# Altium schematic sheet STMkaN.SchDoc
size 209 x 297 mm; 1_Listov: 1; 1_Naimenovanie1: Плата отладочная; 1_Naimenovanie2: STMka-NANO 2v0; 1_Naimenovanie3: Схема электрическая принципиальная; 1_Oboznachenie: КДМТ.466961.001 Э3; 1_T1Razrabotal: Карманов Д.; 1_T2Proveril: Муханов Т.; 1_PervPrimen: КДМТ466961.001; PageSetup: Record=PageOptions|CenterHorizontal=True|CenterVertical=True|PrintScale=0.99|XCorrection=1.00|YCorrection=1.00|PrintKind=2|BorderSize=5000000|LeftOffset=0|BottomOffset=0|Orientation=1|PaperLength=1000|PaperWidth=1000|Scale=100|PaperSource=258|PrintQuality=-3|MediaType=1|DitherType=10|PrintScaleMode=1|PaperKind=A4|PaperIndex=9
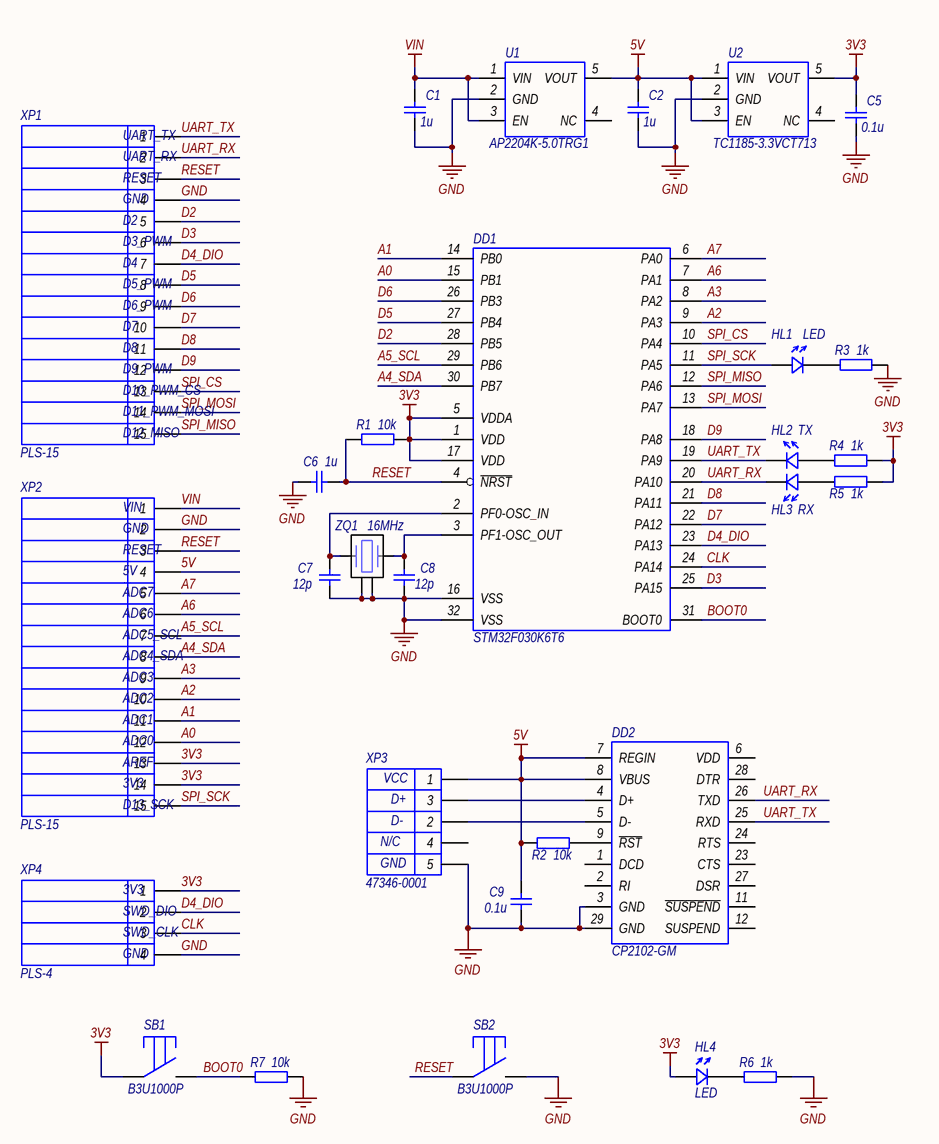
[diagram p0: STMkaN.SchDoc]

## Parts
C1  1u  [0603C]
C2  1u  [0603C]
C5  0.1u  [0603C]
C6  1u  [0603C]
C7  12p  [0603C]
C8  12p  [0603C]
C9  0.1u  [0603C]
DD1  STM32F030K6T6  [TQFP-32]
DD2  CP2102-GM  [QFN-28]
HL1  LED  [0603L]
HL2  TX  [0603L]
HL3  RX  [0603L]
HL4  LED  [0603L]
R1  10k  [0603R]
R2  10k  [0603R]
R3  1k  [0603R]
R4  1k  [0603R]
R5  1k  [0603R]
R6  1k  [0603R]
R7  10k  [0603R]
SB1  B3U1000P  [B3U1000P]
SB2  B3U1000P  [B3U1000P]
U1  AP2204K-5.0TRG1  [SOT23-5]
U2  TC1185-3.3VCT713  [SOT23-5]
XP1  PLS-15  [PLS-15]
XP2  PLS-15  [PLS-15]
XP3  47346-0001  [USB-micro]
XP4  PLS-4  [PLS-4]
ZQ1  16MHz  [SMD0302C4]

## Nets
3V3: C5.2 DD1.1(VDD) DD1.5(VDDA) DD1.17(VDD) HL4.2(A) R1.1 R4.1 R5.1 SB1.1 U2.5(VOUT) XP2.13 XP2.14 XP4.1
5V: C2.2 C9.2 DD2.7(REGIN) DD2.8(VBUS) R2.1 U1.5(VOUT) U2.1(VIN) U2.3(EN) XP2.4 XP3.1
GND: C1.1 C2.1 C5.1 C6.2 C7.1 C8.1 C9.1 DD1.16(VSS) DD1.32(VSS) DD2.3(GND) DD2.29(GND) R3.1 R6.1 R7.2 SB2.2 U1.2(GND) U2.2(GND) XP1.4 XP2.2 XP3.5 XP4.4 ZQ1.2 ZQ1.4
VIN: C1.2 U1.1(VIN) U1.3(EN) XP2.1
A0: DD1.15(PB1) XP2.12
A1: DD1.14(PB0) XP2.11
A2: DD1.9(PA3) XP2.10
A3: DD1.8(PA2) XP2.9
A4_SDA: DD1.30(PB7) XP2.8
A5_SCL: DD1.29(PB6) XP2.7
A6: DD1.7(PA1) XP2.6
A7: DD1.6(PA0) XP2.5
BOOT0: DD1.31(BOOT0) R7.1 SB1.2
CLK: DD1.24(PA14) XP4.3
D2: DD1.28(PB5) XP1.5
D3: DD1.25(PA15) XP1.6
D4_DIO: DD1.23(PA13) XP1.7 XP4.2
D5: DD1.27(PB4) XP1.8
D6: DD1.26(PB3) XP1.9
D7: DD1.22(PA12) XP1.10
D8: DD1.21(PA11) XP1.11
D9: DD1.18(PA8) XP1.12
RESET: C6.1 DD1.4(~{NRST}) R1.2 SB2.1 XP1.3 XP2.3
SPI_CS: DD1.10(PA4) XP1.13
SPI_MISO: DD1.12(PA6) XP1.15
SPI_MOSI: DD1.13(PA7) XP1.14
SPI_SCK: DD1.11(PA5) HL1.2(A) XP2.15
UART_RX: DD1.20(PA10) DD2.26(TXD) HL3.1(K) XP1.2
UART_TX: DD1.19(PA9) DD2.25(RXD) HL2.1(K) XP1.1
NetC7_2: C7.2 DD1.2(PF0-OSC_IN) ZQ1.3
NetC8_2: C8.2 DD1.3(PF1-OSC_OUT) ZQ1.1
NetDD2_4: DD2.4(D+) XP3.3
NetDD2_5: DD2.5(D-) XP3.2
NetDD2_9: DD2.9(~{RST}) R2.2
NetHL1_1: HL1.1(K) R3.2
NetHL2_2: HL2.2(A) R4.2
NetHL3_2: HL3.2(A) R5.2
NetHL4_1: HL4.1(K) R6.2

Not connected (* = marked no-connect by the designer): DD2 1(DCD) 2(RI) 6(VDD) 11(~{SUSPEND}) 12(SUSPEND) 23(CTS) 24(RTS) 27(DSR) 28(DTR); U1 4(NC); U2 4(NC); XP3 4

## Notes on the sheet
- (near XP1) UART_TX
- (near XP1) UART_RX
- (near XP1) RESET
- (near XP1) GND
- (near XP1) D2
- (near XP1) D3_PWM
- (near XP1) D4
- (near XP1) D5_PWM
- (near XP1) D6_PWM
- (near XP1) D7
- (near XP1) D8
- (near XP1) D9_PWM
- (near XP1) D10_PWM_CS
- (near XP1) D11_PWM_MOSI
- (near XP1) D12_MISO
- (near XP2) VIN
- (near XP2) GND
- (near XP2) RESET
- (near XP2) 5V
- (near XP2) ADC7
- (near XP2) ADC6
- (near XP2) ADC5_SCL
- (near XP2) ADC4_SDA
- (near XP2) ADC3
- (near XP2) ADC2
- (near XP2) ADC1
- (near XP2) ADC0
- (near XP2) AREF
- (near XP2) 3V3
- (near XP3) VCC
- (near XP2) D13_SCK
- (near XP3) N/C
- (near XP3) D-
- (near XP3) D+
- (near XP4) 3V3
- (near XP4) SWD_DIO
- (near XP3) GND
- (near XP4) SWD_CLK
- (near XP4) GND
- Перв. примен.
- Справ. №
- Подп. и дата
- Инв. № дубл.
- Взам. инв. №
- Изм
- Лист
- № докум.
- Подпись
- Дата
- Лит.
- Масса
- Масштаб
- Разраб.
- Пров.
- Т. контр.
- Листов
- Инв. № подл.
- Н. контр.
- Утв
- Копировал:
- Формат А4

## Library data of the parts
C1 C2 C5-C9 = SMD-CAP: Capacitor
DD1 = STM32F030K6T6: Controller
DD2 = CP2102
HL1 HL4 = LEDx1
HL2 HL3 = LEDx1: LED
R1-R7 = SMD-RES: Resistor
SB1 SB2 = SWITCH: Button
U1 U2 = TPS76333DBVR: POWER
XP1 XP2 = XP15: Connector
XP3 = USB-micro: Connector
XP4 = XP4: Connector
ZQ1 = Quartz